# Altium project Velvet_Controller_V2.0_2023.PrjPcb (part 1 of 3)
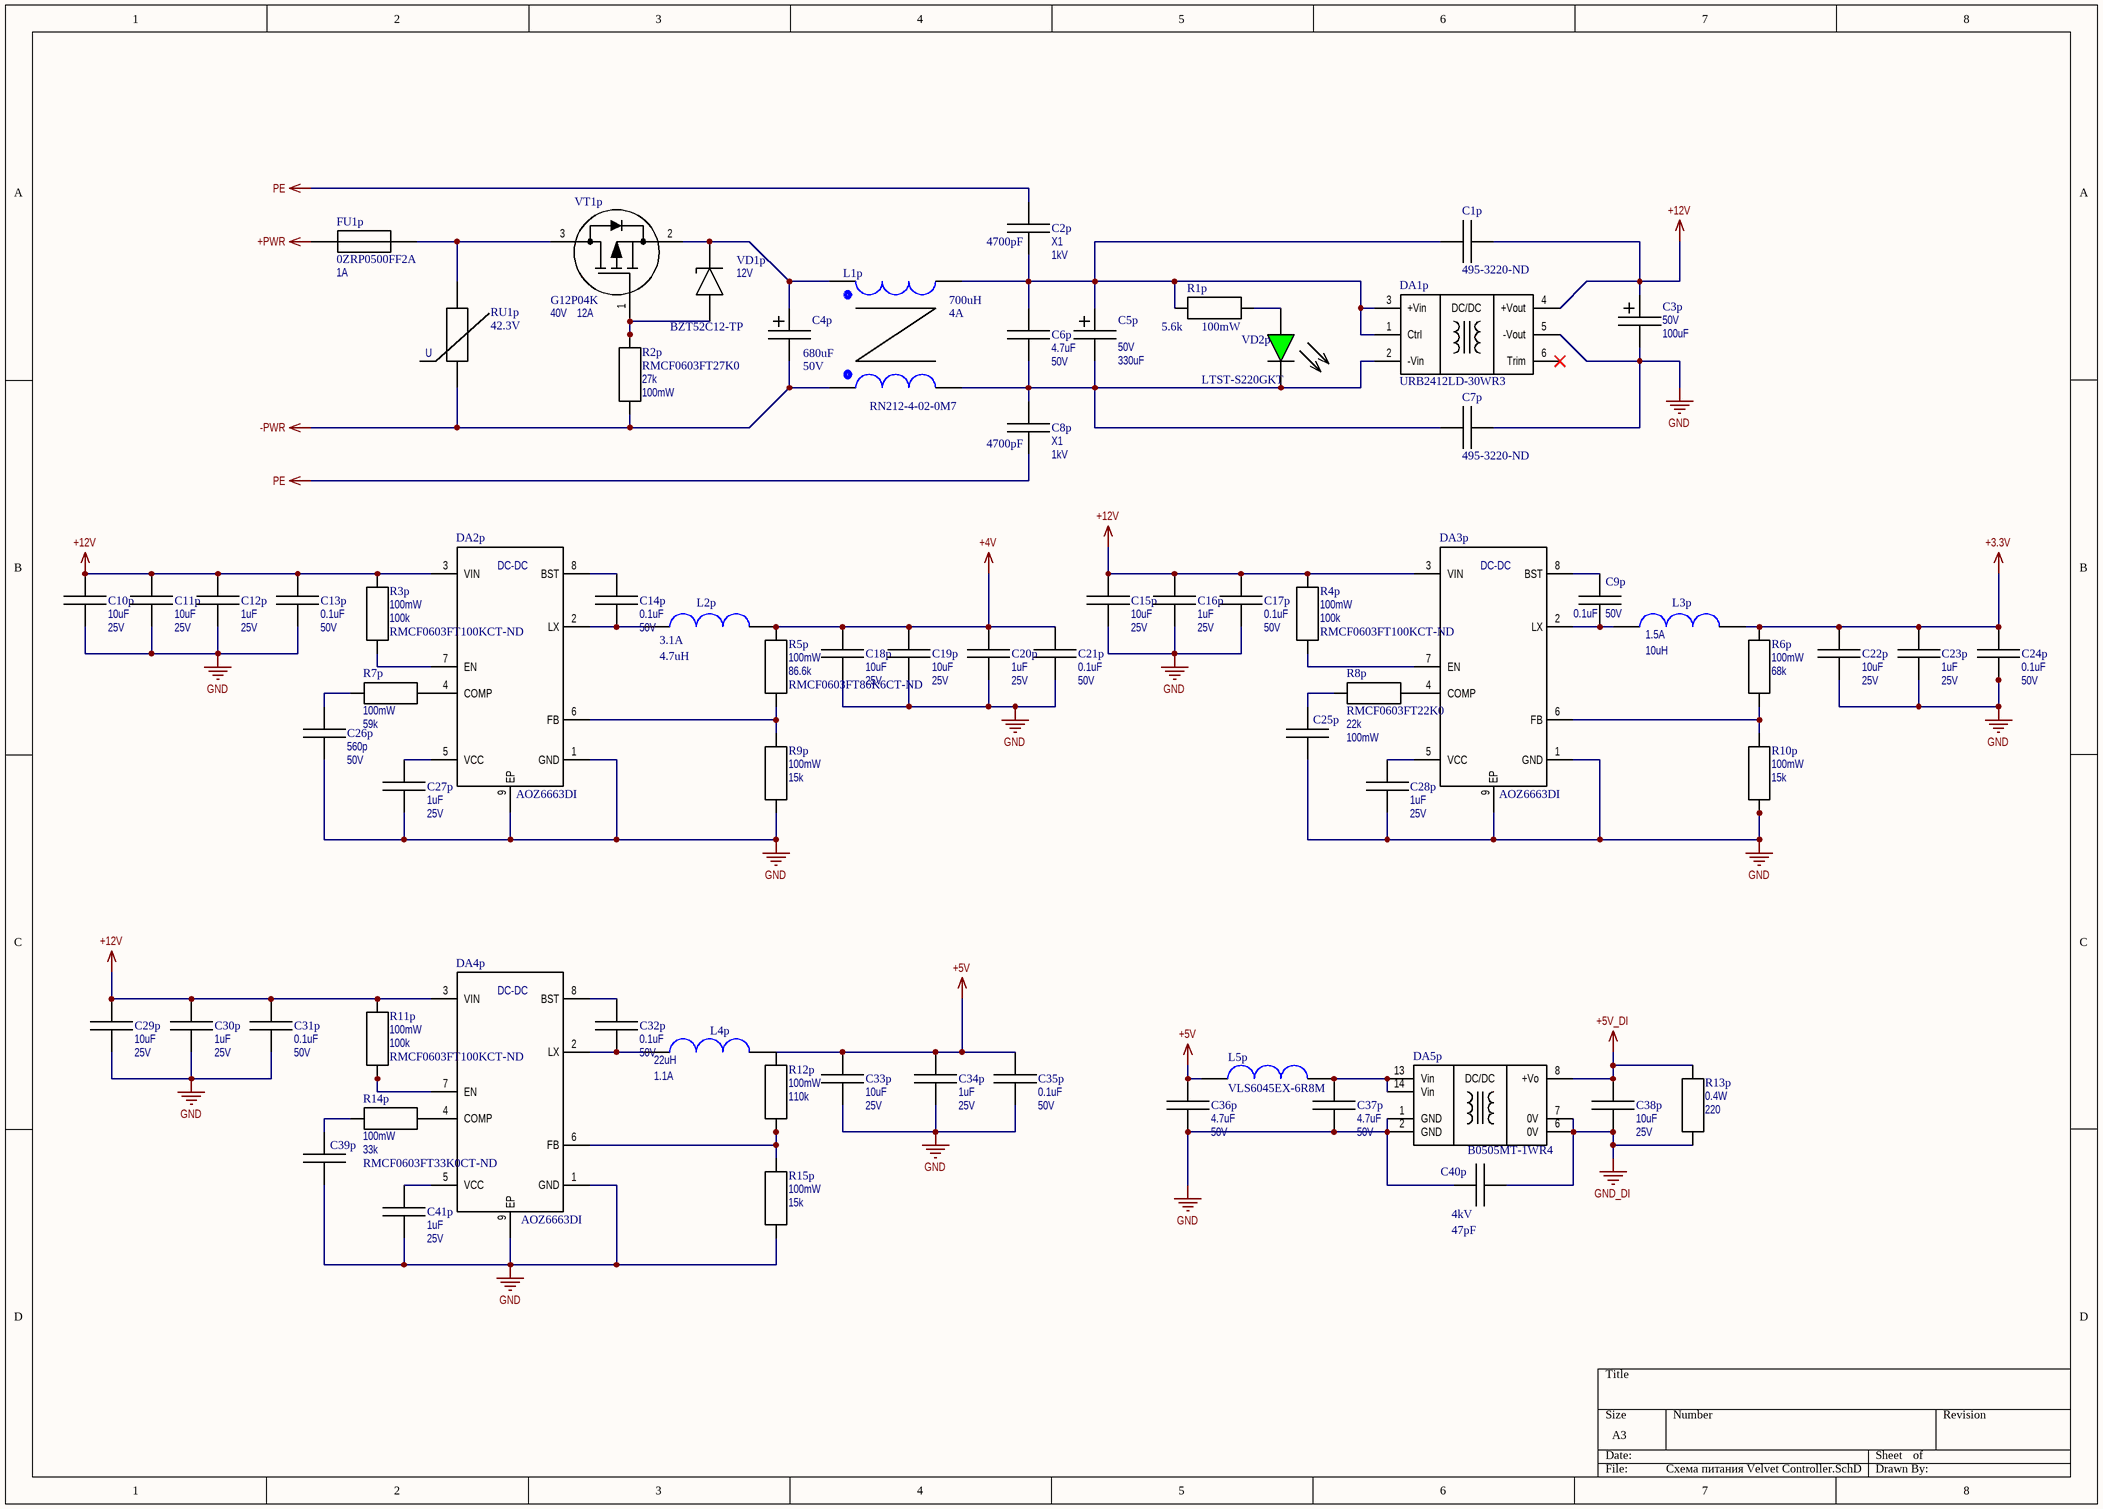
[diagram p0: Схема питания Velvet Controller.SchDoc]
6 sheets, 335 parts. Net scope: global (net labels, ports and power ports of the same name join across sheets).
Board file: Velvet_Controller_V2.0_2023.PcbDoc
Sheets:
  Схема питания Velvet Controller.SchDoc
  Схема МК и датчиков Velvet Controller.SchDoc
  Схема LoRa и RFID Velvet Controller.SchDoc
  Схема Wi-Fi Velvet Controller.SchDoc
  Схема GSM Velvet Controller.SchDoc
  Схема дискретных входов и выходов.SchDoc

## Sheet Схема питания Velvet Controller.SchDoc
size A3; SheetNumber: 1; SheetTotal: 6

### Parts
C1p  Supplier Part Number 1: 495-3220-ND  [CAP RADIAL L18.0 W5.0 H10.5 P15.0]  (hidden comment: B32672L8122J000)
C2p  Capacitance: 4700pF  Type: X1  Rated Voltage: 1kV  [CAP RADIAL L13.0 W4.0 H9.1 P10.0]  (hidden comment: R474F147050A1M)
C3p  Voltage Rated: 50V  Capacitance: 100uF  [CAP RADIAL D8.0 L12.0 P5.0]  (hidden comment: ECA-1HM101B)
C4p  Capacitance: 680uF  Voltage Rated: 50V  [CAP RADIAL D12.5 L20.0 P5.0]  (hidden comment: 50PX680MEFC12.5X20)
C5p  Voltage Rated: 50V  Capacitance: 330uF  [CAP RADIAL D10.0 L17,0 P5.0]  (hidden comment: ECA-1HM331B)
C6p  Capacitance: 4.7uF  Rated Voltage: 50V  [CAP 0805 IPC MAX]  (hidden comment: CL21A475KBQNNNE)
C7p  Supplier Part Number 1: 495-3220-ND  [CAP RADIAL L18.0 W5.0 H10.5 P15.0]  (hidden comment: B32672L8122J000)
C8p  Capacitance: 4700pF  Type: X1  Rated Voltage: 1kV  [CAP RADIAL L13.0 W4.0 H9.1 P10.0]  (hidden comment: R474F147050A1M)
C9p  Capacitance: 0.1uF  Rated Voltage: 50V  [CAP 0603 IPC MAX]  (hidden comment: GCM188R71H104KA57D)
C10p  Capacitance: 10uF  Rated Voltage: 25V  [CAP 1206 IPC MAX]  (hidden comment: CL31B106KAHNNNE)
C11p  Capacitance: 10uF  Rated Voltage: 25V  [CAP 1206 IPC MAX]  (hidden comment: CL31B106KAHNNNE)
C12p  Capacitance: 1uF  Rated Voltage: 25V  [CAP 0603 IPC MAX]  (hidden comment: TMK107BJ105KA-T)
C13p  Capacitance: 0.1uF  Rated Voltage: 50V  [CAP 0603 IPC MAX]  (hidden comment: GCM188R71H104KA57D)
C14p  Capacitance: 0.1uF  Rated Voltage: 50V  [CAP 0603 IPC MAX]  (hidden comment: GCM188R71H104KA57D)
C15p  Capacitance: 10uF  Rated Voltage: 25V  [CAP 1206 IPC MAX]  (hidden comment: CL31B106KAHNNNE)
C16p  Capacitance: 1uF  Rated Voltage: 25V  [CAP 0603 IPC MAX]  (hidden comment: TMK107BJ105KA-T)
C17p  Capacitance: 0.1uF  Rated Voltage: 50V  [CAP 0603 IPC MAX]  (hidden comment: GCM188R71H104KA57D)
C18p  Capacitance: 10uF  Rated Voltage: 25V  [CAP 1206 IPC MAX]  (hidden comment: CL31B106KAHNNNE)
C19p  Capacitance: 10uF  Rated Voltage: 25V  [CAP 1206 IPC MAX]  (hidden comment: CL31B106KAHNNNE)
C20p  Capacitance: 1uF  Rated Voltage: 25V  [CAP 0603 IPC MAX]  (hidden comment: TMK107BJ105KA-T)
C21p  Capacitance: 0.1uF  Rated Voltage: 50V  [CAP 0603 IPC MAX]  (hidden comment: GCM188R71H104KA57D)
C22p  Capacitance: 10uF  Rated Voltage: 25V  [CAP 1206 IPC MAX]  (hidden comment: CL31B106KAHNNNE)
C23p  Capacitance: 1uF  Rated Voltage: 25V  [CAP 0603 IPC MAX]  (hidden comment: TMK107BJ105KA-T)
C24p  Capacitance: 0.1uF  Rated Voltage: 50V  [CAP 0603 IPC MAX]  (hidden comment: GCM188R71H104KA57D)
C25p  CAP  [RES 0603 IPC MAX]  (value not drawn)
C26p  Capacitance: 560p  Rated Voltage: 50V  [CAP 0603 IPC MAX]  (hidden comment: CC0603KRX7R9BB561)
C27p  Capacitance: 1uF  Rated Voltage: 25V  [CAP 0603 IPC MAX]  (hidden comment: TMK107BJ105KA-T)
C28p  Capacitance: 1uF  Rated Voltage: 25V  [CAP 0603 IPC MAX]  (hidden comment: TMK107BJ105KA-T)
C29p  Capacitance: 10uF  Rated Voltage: 25V  [CAP 1206 IPC MAX]  (hidden comment: CL31B106KAHNNNE)
C30p  Capacitance: 1uF  Rated Voltage: 25V  [CAP 0603 IPC MAX]  (hidden comment: TMK107BJ105KA-T)
C31p  Capacitance: 0.1uF  Rated Voltage: 50V  [CAP 0603 IPC MAX]  (hidden comment: GCM188R71H104KA57D)
C32p  Capacitance: 0.1uF  Rated Voltage: 50V  [CAP 0603 IPC MAX]  (hidden comment: GCM188R71H104KA57D)
C33p  Capacitance: 10uF  Rated Voltage: 25V  [CAP 1206 IPC MAX]  (hidden comment: CL31B106KAHNNNE)
C34p  Capacitance: 1uF  Rated Voltage: 25V  [CAP 0603 IPC MAX]  (hidden comment: TMK107BJ105KA-T)
C35p  Capacitance: 0.1uF  Rated Voltage: 50V  [CAP 0603 IPC MAX]  (hidden comment: GCM188R71H104KA57D)
C36p  Capacitance: 4.7uF  Rated Voltage: 50V  [CAP 0805 IPC MAX]  (hidden comment: CL21A475KBQNNNE)
C37p  Capacitance: 4.7uF  Rated Voltage: 50V  [CAP 0805 IPC MAX]  (hidden comment: CL21A475KBQNNNE)
C38p  Capacitance: 10uF  Rated Voltage: 25V  [CAP 1206 IPC MAX]  (hidden comment: CL31B106KAHNNNE)
C39p  CAP  [RES 0603 IPC MAX]  (value not drawn)
C40p  Capacitance: 47pF  Rated Voltage: 4kV  [CC45SL3JD470JYVNA]  (hidden comment: CC45SL3JD470JYVNA)
C41p  Capacitance: 1uF  Rated Voltage: 25V  [CAP 0603 IPC MAX]  (hidden comment: TMK107BJ105KA-T)
DA1p  URB2412LD-30WR3  [URB2412LD-30WR3]
DA2p  AOZ6663DI  [DFN 3x3-8L]
DA3p  AOZ6663DI  [DFN 3x3-8L]
DA4p  AOZ6663DI  [DFN 3x3-8L]
DA5p  B0505MT-1WR4  [B0505MT-1WR4]
FU1p  0ZRP0500FF2A  Current Hold: 1A  [0ZRP0500FF2A]
L1p  RN212-4-02-0M7  Inductance: 700uH  Current Rating: 4A  [FIXED IND RN212-4-02-0M7]
L2p  Inductance: 4.7uH  Current Rating: 3.1A  [SRN5040]  (hidden comment: SRN5040-4R7M)
L3p  Inductance: 10uH  Current Rating: 1.5A  [ASPI-4030S]  (hidden comment: ASPI-4030S-100M-T)
L4p  Inductance: 22uH  Current Rating: 1.1A  [TYS5020]  (hidden comment: TYS5020220M-10)
L5p  VLS6045EX-6R8M  [VLS6045EX]
R1p  Resistance: 5.6k  Rated Power: 100mW  [RES 0603 IPC MAX]  (hidden comment: RMCF0603FT5K60)
R2p  RMCF0603FT27K0  Resistance: 27k  Rated Power: 100mW  [RES 0603 IPC MAX]
R3p  Power Rated: 100mW  Resistance: 100k  Supplier Part Number 1: RMCF0603FT100KCT-ND  [RES 0603 IPC MAX]  (hidden comment: RMCF0603FT100K)
R4p  Power Rated: 100mW  Resistance: 100k  Supplier Part Number 1: RMCF0603FT100KCT-ND  [RES 0603 IPC MAX]  (hidden comment: RMCF0603FT100K)
R5p  Power Rated: 100mW  Resistance: 86.6k  Supplier Part Number 1: RMCF0603FT86K6CT-ND  [RES 0603 IPC MAX]  (hidden comment: RMCF0603FT86K6)
R6p  Power Rated: 100mW  Resistance: 68k  [RES 0603 IPC MAX]  (hidden comment: RMCF0603FT68K0)
R7p  Power Rated: 100mW  Resistance: 59k  [RES 0603 IPC MAX]  (hidden comment: RMCF0603FT59K0)
R8p  RMCF0603FT22K0  Resistance: 22k  Power Rated: 100mW  [RES 0603 IPC MAX]
R9p  Power Rated: 100mW  Resistance: 15k  [RES 0603 IPC MAX]  (hidden comment: RMCF0603FT15K0)
R10p  Power Rated: 100mW  Resistance: 15k  [RES 0603 IPC MAX]  (hidden comment: RMCF0603FT15K0)
R11p  Power Rated: 100mW  Resistance: 100k  Supplier Part Number 1: RMCF0603FT100KCT-ND  [RES 0603 IPC MAX]  (hidden comment: RMCF0603FT100K)
R12p  Power Rated: 100mW  Resistance: 110k  [RES 0603 IPC MAX]  (hidden comment: RMCF0603FT110K)
R13p  Power Rated: 0.4W  Resistance: 220  [RES 0805 IPC MAX]  (hidden comment: ESR10EZPF2200)
R14p  Power Rated: 100mW  Resistance: 33k  Supplier Part Number 1: RMCF0603FT33K0CT-ND  [RES 0603 IPC MAX]  (hidden comment: RMCF0603FT33K0)
R15p  Power Rated: 100mW  Resistance: 15k  [RES 0603 IPC MAX]  (hidden comment: RMCF0603FT15K0)
RU1p  Varistor Voltage (Min): 42.3V  [B72220S0300K101]  (hidden comment: B72220S0300K101)
VD1p  BZT52C12-TP  Zener Voltage: 12V  [SOD-123 (Marked)]
VD2p  LTST-S220GKT  [0805 DIODE]
VT1p  G12P04K  Vds Max: 40V  Max Drain Current: 12A  [TO-252 (D-PAK)]

### Nets
+3.3V: C22p.1 C23p.1 C24p.1 L3p.2 R6p.1
+4V: C18p.1 C19p.1 C20p.1 C21p.1 L2p.2 R5p.1
+5V: C33p.1 C34p.1 C35p.1 C36p.1 L4p.2 L5p.1 R12p.2
+5V_DI: C38p.1 DA5p.8(+Vo) R13p.2
+12V: C1p.2 C3p.1 C10p.1 C11p.1 C12p.1 C13p.1 C15p.1 C16p.1 C17p.1 C29p.1 C30p.1 C31p.1 DA1p.4(+Vout) DA2p.3(VIN) DA3p.3(VIN) DA4p.3(VIN) R3p.2 R4p.1 R11p.1
+PWR: FU1p.1
-PWR: C4p.2 L1p.3 R2p.1 RU1p.1
GND: C3p.2 C7p.2 C10p.2 C11p.2 C12p.2 C13p.2 C15p.2 C16p.2 C17p.2 C18p.2 C19p.2 C20p.2 C21p.2 C22p.2 C23p.2 C24p.2 C25p.2 C26p.2 C27p.2 C28p.2 C29p.2 C30p.2 C31p.2 C33p.2 C34p.2 C35p.2 C36p.2 C37p.2 C39p.2 C40p.1 C41p.2 DA1p.5(-Vout) DA2p.1(GND) DA2p.9(EP) DA3p.1(GND) DA3p.9(EP) DA4p.1(GND) DA4p.9(EP) DA5p.1(GND) DA5p.2(GND) R9p.1 R10p.1 R15p.1
GND_DI: C38p.2 C40p.2 DA5p.6(0V) DA5p.7(0V) R13p.1
PE: C2p.1 C8p.2
NetC1p_1: C1p.1 C2p.2 C5p.1 C6p.1 DA1p.1(Ctrl) DA1p.3(+Vin) L1p.2 R1p.1
NetC4p_1: C4p.1 L1p.1 VD1p.1 VT1p.2(S)
NetC5p_2: C5p.2 C6p.2 C7p.1 C8p.1 DA1p.2(-Vin) L1p.4 VD2p.2
NetC9p_1: C9p.1 DA3p.8(BST)
NetC9p_2: C9p.2 DA3p.2(LX) L3p.1
NetC14p_1: C14p.1 DA2p.8(BST)
NetC14p_2: C14p.2 DA2p.2(LX) L2p.1
NetC25p_1: C25p.1 R8p.1
NetC26p_1: C26p.1 R7p.1
NetC27p_1: C27p.1 DA2p.5(VCC)
NetC28p_1: C28p.1 DA3p.5(VCC)
NetC32p_1: C32p.1 DA4p.8(BST)
NetC32p_2: C32p.2 DA4p.2(LX) L4p.1
NetC37p_1: C37p.1 DA5p.13(Vin) DA5p.14(Vin) L5p.2
NetC39p_1: C39p.1 R14p.2
NetC41p_1: C41p.1 DA4p.5(VCC)
NetDA2p_4: DA2p.4(COMP) R7p.2
NetDA2p_6: DA2p.6(FB) R5p.2 R9p.2
NetDA2p_7: DA2p.7(EN) R3p.1
NetDA3p_4: DA3p.4(COMP) R8p.2
NetDA3p_6: DA3p.6(FB) R6p.2 R10p.2
NetDA3p_7: DA3p.7(EN) R4p.2
NetDA4p_4: DA4p.4(COMP) R14p.1
NetDA4p_6: DA4p.6(FB) R12p.1 R15p.2
NetDA4p_7: DA4p.7(EN) R11p.2
NetFU1p_2: FU1p.2 RU1p.2 VT1p.3(D)
NetR1p_2: R1p.2 VD2p.1
NetR2p_2: R2p.2 VD1p.2 VT1p.1(G)

Not connected (* = marked no-connect by the designer): DA1p 6(Trim)*

### Notes on the sheet
- (in symbol AOZ6663DI) DC-DC
- (in symbol B0505MT-1WR4) DC/DC
- (in symbol B72220S0300K101) U
- (in symbol URB2412LD-30WR3) DC/DC

### Library data of the parts
C1p C7p = B32672L8122J000: CAP FILM 1200PF 5% 2KVDC RADIAL; Manufacturer 1: EPCOS - TDK Electronics; Rated Voltage: 2kV; Type: MKP; Manufacturer Part Number 1: B32672L8122J000; Min Operating Temperature: -55°C; Max Operating Temperature: 110°C; Capacitance: 1200pF; Tolerance: 5%; Mounting: T/H; Package: 18mm x 5mm x 10.5mm; Lead Spacing: 15mm; Supplier 1: Digi-Key
C2p C8p = R474F147050A1M: CAP FILM 4700PF 20% 1KVDC RAD; Manufacturer 1: KEMET; Manufacturer Part Number 1: R474F147050A1M; Min Operating Temperature: -40°C; Max Operating Temperature: 110°C; Tolerance: 20%; Mounting: T/H; Package: 13mm x 4mm x 9.1mm; Lead Spacing: 10mm; Supplier 1: Digi-Key; Supplier Part Number 1: 399-13727-ND
C3p = ECA-1HM101B: CAP ALUM 100UF 20% 50V RADIAL; Manufacturer 1: Panasonic Electronic Components; Capacitor Type: Aluminium Electrolytic; Ripple Current @ Low Frequency: 250mA; Ripple Current @ High Frequency: 425mA; Manufacturer Part Number 1: ECA-1HM101B; Min Operating Temperature: -40°C; Max Operating Temperature: 85°C; Lead Spacing: 5mm; Diameter: 8mm; Height: 12.5mm; Tolerance: 20%; Supplier 1: Digi-Key; Supplier Part Number 1: P5182-ND
C4p = 50PX680MEFC12.5X20: CAP ALUM 680UF 20% 50V RADIAL; Manufacturer 1: Rubycon; Capacitor Type: Aluminium Electrolytic; Ripple Current @ Low Frequency: 980mA; Ripple Current @ High Frequency: 1.176A; Manufacturer Part Number 1: 50PX680MEFC12.5X20; Min Operating Temperature: -55°C; Max Operating Temperature: 105°C; Lead Spacing: 5mm; Diameter: 12.5mm; Height: 21.5mm; Tolerance: 20%
C5p = ECA-1HM331B: CAP ALUM 330UF 20% 50V RADIAL; Manufacturer 1: Panasonic Electronic Components; Capacitor Type: Aluminium Electrolytic; Ripple Current @ Low Frequency: 500mA; Ripple Current @ High Frequency: 850A; Manufacturer Part Number 1: ECA-1HM331B; Min Operating Temperature: -40°C; Max Operating Temperature: 85°C; Lead Spacing: 5mm; Diameter: 10mm; Height: 17mm; Tolerance: 20%
C6p C36p C37p = CL21A475KBQNNNE: CAP SMD CER 4.7UF 50V X5R 0805; Manufacturer 1: Samsung Electro-Mechanics; Tolerance: 10%; Type: Multilayer Ceramic; Manufacturer Part Number 1: CL21A475KBQNNNE; Min Operating Temperature: -55°C; Max Operating Temperature: 85°C; Mounting: SM; Package: 0805; Supplier 1: Digi-Key; Supplier Part Number 1: 1276-1248-1-ND
C9p C13p C14p C17p C21p C24p C31p C32p C35p = GCM188R71H104KA57D: CAP SMD CER 0.1UF 50V X7R 0603; Manufacturer 1: Murata Electronics; Tolerance: 10%; Type: Multilayer Ceramic; Manufacturer Part Number 1: GCM188R71H104KA57D; Min Operating Temperature: -55°C; Max Operating Temperature: 125°C; Mounting: SM; Package: 0603; Supplier 1: Digi-Key; Supplier Part Number 1: 490-4779-1-ND
C10p C11p C15p C18p C19p C22p C29p C33p C38p = CL31B106KAHNNNE: CAP SMD CER 10UF 25V X7R 1206; Manufacturer 1: Samsung Electro-Mechanics; Tolerance: 10%; Type: Multilayer Ceramic; Manufacturer Part Number 1: CL31B106KAHNNNE; Min Operating Temperature: -55°C; Max Operating Temperature: 125°C; Mounting: SM; Package: 1206; Supplier 1: Digi-Key; Supplier Part Number 1: 1276-1804-1-ND
C12p C16p C20p C23p C27p C28p C30p C34p C41p = TMK107BJ105KA-T: CAP SMD CER 1UF 25V X5R 0603; Manufacturer 1: Taiyo Yuden; Tolerance: 10%; Type: Multilayer Ceramic; Manufacturer Part Number 1: TMK107BJ105KA-T; Min Operating Temperature: -55°C; Max Operating Temperature: 85°C; Mounting: SM; Package: 0603; Supplier 1: Digi-Key; Supplier Part Number 1: 587-1248-1-ND
C25p C39p = CAP GOST: CAP ??UF ??% ??V Package?
C26p = CC0603KRX7R9BB561: CAP SMD CER 560PF 50V X7R 0603; Manufacturer 1: YAGEO; Tolerance: 10%; Type: Multilayer Ceramic; Manufacturer Part Number 1: CC0603KRX7R9BB561; Min Operating Temperature: -55°C; Max Operating Temperature: 125°C; Mounting: SM; Package: 0603; Supplier 1: Digi-Key; Supplier Part Number 1: 311-1079-1-ND
C40p = CC45SL3JD470JYVNA: CAP SMD CER 47PF 6KV SL RADIAL; Manufacturer 1: TDK Corporation; Tolerance: 5%; Type: High Voltage; Manufacturer Part Number 1: CC45SL3JD470JYVNA; Min Operating Temperature: -25°C; Max Operating Temperature: 125°C; Mounting: T/H; Package: Radial
DA1p = URB2412LD-30WR3: DC DC CONVERTER 12V 30W; Max Input Voltage DC: 36V; Min Input Voltage DC: 9V; Max Output Current: 2.5A; Efficiency: 90%; Output Voltage Ripple: 100mV; Operating Frequency: 300kHz; Output Voltage DC: 12V; Power Rating: 30W; Application: ITE (Commercial); Min Operating Temperature: +80℃; Max Operating Temperature: -40℃; Mounting Type: T/H; Pins: 6; Size: 50.8mm x 25.4mm x 11.8mm; Help URL: https://www.mornsun-power.com/html/pdf/URB2412LD-30WR3.html; Supplier 1: Digi-Key; Supplier Part Number 1: 2725-URB2412LD-30WR3-ND
DA2p DA3p DA4p = AOZ6663DI: IC REG BUCK ADJ 3A 8DFN; Manufacturer 1: Alpha & Omega Semiconductor Inc.; Min Input Voltage: 4.5V; Max Input Voltage: 20V; Min Output Voltage: 0.6V; Max Output Voltage: 7V; Max Operating Frequency: 750kHz; Max Pulsed Current: 3.2A; Supplier 1: Digi-Key; Supplier Part Number 1: 785-1855-1-ND; Manufacturer Part Nubmer 1: AOZ6663DI; Type: Buck
DA5p = B0505MT-1WR4: DC DC CONVERTER 5V 1W; Max Input Voltage DC: 5.5V; Min Input Voltage DC: 4.5V; Max Output Current: 200mA; Efficiency: 8%; Output Voltage Ripple: 100mV; Operating Frequency: 300kHz; Output Voltage DC: 5V; Power Rating: 1W; Application: ITE (Commercial); Min Operating Temperature: +125℃; Max Operating Temperature: -40℃; Mounting Type: SM; Pins: 7; Size: L9.0W7.0H3.1P1.27; Help URL: https://www.mornsun-power.com/html/pdf/B0505MT-1WR4.html; Supplier 1: Digi-Key; Supplier Part Number 1: 2725-B0505MT-1WR4CT-ND
FU1p = 0ZRP0500FF2A: PTC RESET FUSE 60V 5A RADIAL; Manufacturer 1: Bel Fuse Inc.; Current Trip: 10A; Time To Trip: 28s; Initial Resistance: 12mOhm; Max Current: 40A; Min Operating Temperature: -40°C; Max Operating Temperature: 85°C; Manufacturer Part Number 1: 0ZRP0500FF2A; Supplier 1: Digi-Key; Supplier Part Number 1: 507-0ZRP0500FF2ACT-ND
L1p = RN212-4-02-0M7: COMMON MODE CHOKE 700UH 4A 2LN TH; Manufacturer 1: Schaffner EMC Inc.; Shielding: Yes; DCR: 24mOhm; Manufacturer Part Number 1: RN212-4-02-0M7; Saturation Current: -; Min Operating Temperature: -40°C; Max Operating Temperature: 125°C; Supplier 1: Digi-Key; Supplier Part Number 1: 817-2176-ND
L2p = SRN5040-4R7M: FIXED IND 4.7UH 3.1A 35 MOHM SMD; Manufacturer 1: Bourns; Saturation Current: 3.3A; Shielding: Yes; DCR: 35mOhm; Manufacturer Part Number 1: SRN5040-4R7M; Min Operating Temperature: -40°C; Max Operating Temperature: 125°C; Supplier 1: Digi-Key; Supplier Part Number 1: SRN5040-4R7MCT-ND
L3p = ASPI-4030S-100M-T: FIXED IND 10UH 1.5A 100 MOHM SMD; Manufacturer 1: Abracon LLC; Saturation Current: 1.95A; Shielding: Yes; Manufacturer Part Number 1: ASPI-4030S-100M-T; DCR: 100mOhm; Min Operating Temperature: -40°C; Max Operating Temperature: 125°C; Supplier 1: Digi-Key; Supplier Part Number 1: 535-12314-1-ND
L4p = TYS5020220M-10: FIXED IND 22UH 1.1A 226 MOHM SMD; Manufacturer 1: Laird-Signal Integrity Products; Saturation Current: 1.15A; Shielding: Yes; Manufacturer Part Number 1: TYS5020220M-10; DCR: 226mOhm; Min Operating Temperature: -40°C; Max Operating Temperature: 125°C; Supplier 1: Digi-Key; Supplier Part Number 1: 240-2706-1-ND
L5p = VLS6045EX-6R8M: FIXED IND 6.8UH 3.6A 36 MOHM SMD; Manufacturer 1: TDK Corporation; Saturation Current: 4.7A; Shielding: Yes; DCR: 36mOhm; Manufacturer Part Number 1: VLS6045EX-6R8M; Inductance: 6.8uH; Current Rating: 3.6A; Min Operating Temperature: -40°C; Max Operating Temperature: 105°C; Supplier 1: Digi-Key; Supplier Part Number 1: 445-173057-1-ND
R1p = RMCF0603FT5K60: RES SMD 5.6K OHM 1% 1/10W 0603; Manufacturer Part Number 1: RMCF0603FT1K00; Manufacturer 1: Stackpole Electronics Inc; Rated Voltage: 75V; Qualification: AEC-Q200; Tolerance: 1%; Package: 0603; Min Operating Temperature: -55°C; Max Operating Temperature: 155°C
R2p = RMCF0603FT27K0: RES SMD 27K OHM 1% 1/10W 0603; Manufacturer 1: Stackpole Electronics Inc; Manufacturer Part Number 1: RMCF0603FT22K0; Rated Voltage: 75V; Max Operating Temperature: 155°C; Min Operating Temperature: -55°C; Tolerance: 1%; Package: 0603; Mounting: SM; Pins: 2; Ratings: AEC-Q200; Supplier 1: Digi-Key; Supplier Part Number 1: RMCF0603FT27K0CT-ND
R3p R4p R11p = RMCF0603FT100K: RES SMD 100K OHM 5% 1/10W 0603; Manufacturer 1: Stackpole Electronics Inc; Voltage Rated: 75V; Manufacturer Part Number 1: RMCF0603FT100K; Min Operating Temperature: -55°C; Max Operating Temperature: 155°C; Tolerance: 5%; Package: 0603; Ratings: AEC-Q200; Supplier 1: Digi-Key
R5p = RMCF0603FT86K6: RES SMD 86.6K OHM 5% 1/10W 0603; Manufacturer 1: Stackpole Electronics Inc; Voltage Rated: 75V; Manufacturer Part Number 1: RMCF0603FT86K6; Min Operating Temperature: -55°C; Max Operating Temperature: 155°C; Tolerance: 5%; Package: 0603; Ratings: AEC-Q200; Supplier 1: Digi-Key
R6p = RMCF0603FT68K0: RES SMD 68K OHM 1% 1/10W 0603; Manufacturer 1: Stackpole Electronics Inc; Voltage Rated: 75V; Manufacturer Part Number 1: RMCF0603FT68K0; Min Operating Temperature: -55°C; Max Operating Temperature: 155°C; Tolerance: 1%; Package: 0603; Ratings: AEC-Q200; Supplier 1: Digi-Key; Supplier Part Number 1: RMCF0603FT68K0CT-ND
R7p = RMCF0603FT59K0: RES SMD 59K OHM 5% 1/10W 0603; Manufacturer 1: Stackpole Electronics Inc; Voltage Rated: 75V; Manufacturer Part Number 1: RMCF0603FT59K0; Min Operating Temperature: -55°C; Max Operating Temperature: 155°C; Tolerance: 5%; Package: 0603; Ratings: AEC-Q200; Supplier 1: Digi-Key; Supplier Part Number 1: RMCF0603FT59K0CT-ND
R8p = RMCF0603FT22K0: RES SMD 22K OHM 1% 1/10W 0603; Manufacturer 1: Stackpole Electronics Inc; Min Operating Temnperature: -55°C; Voltage Rated: 75V; Manufacturer Part Number 1: RMCF0603FT22K0; Max Operating Temperature: 155°C; Tolerance: 1%; Package: 0603; Mounting: SM; Pins: 2; Rating: AEC-Q200; Supplier 1: Digi-Key; Supplier Part Number 1: RMCF0603FT22K0CT-ND
R9p R10p R15p = RMCF0603FT15K0: RES SMD 15K OHM 1% 1/10W 0603; Manufacturer 1: Stackpole Electronics Inc; Voltage Rated: 75V; Manufacturer Part Number 1: RMCF0603FT15K0; Min Operating Temperature: -55°C; Max Operating Temperature: 155°C; Tolerance: 1%; Package: 0603; Ratings: AEC-Q200; Supplier 1: Digi-Key; Supplier Part Number 1: RMCF0603FT15K0CT-ND
R12p = RMCF0603FT110K: RES SMD 110K OHM 1% 1/10W 0603; Manufacturer 1: Stackpole Electronics Inc; Voltage Rated: 75V; Tolerance: 5%; Manufacturer Part Number 1: RMCF0603FT110K; Min Operating Temperature: -55°C; Max Operating Temperature: 155°C; Package: 0603; Ratings: AEC-Q200; Supplier 1: Digi-Key; Supplier Part Number 1: RMCF0603FT110KCT-ND
R13p = ESR10EZPF2200: RES SMD 220 OHM 1% 0.4W 0805; Manufacturer 1: Rohm Semiconductor; Voltage Rated: 100V; Manufacturer Part Number 1: ESR10EZPF2200; Min Operating Temperature: -55°C; Max Operating Temperature: 155°C; Tolerance: 1%; Package: 0805; Ratings: AEC-Q200; Supplier 1: Digi-Key; Supplier Part Number 1: RHM220AECT-ND
R14p = RMCF0603FT33K0: RES SMD 33K OHM 1% 1/10W 0603; Manufacturer 1: Stackpole Electronics Inc; Voltage Rated: 75V; Manufacturer Part Number 1: RMCF0603FT33K0; Min Operating Temperature: -55°C; Max Operating Temperature: 155°C; Tolerance: 1%; Package: 0603; Ratings: AEC-Q200; Supplier 1: Digi-Key
RU1p = B72220S0300K101: VARISTOR 47V 2KA DISC 20MM S20K30; Manufacturer: EPCOS Inc; Number of Circuits: 1; Maximum AC Volts: 30V; Maximum DC Volts: 38W; Energy: 26J; Manufacturer Part Number: B72220S0300K101; RoHS Compliant: Yes; Current - Surge: 2kA; Package / Case: Disc 20mm; ComponentLink1URL: https://www.tdk-electronics.tdk.com/inf/70/db/var/SIOV_Leaded_StandarD.pdf?ref_disty=digikey; ComponentLink1Description: Datasheet; Supplier 1: Digi-Key; Supplier Part Number 1: 495-2405-ND
VD1p = BZT52C12-TP: DIODE ZENER 12V 200MW SOD123; Manufacturer 1: Micro Commercial Co; Tolerance: 5%; Max Impedance: 28 Ohm; Reverse Current: 100nA; Manufacturer Part Number 1: BZT52C12-TP; Min Operating Temperature: -65°C; Max Operating Temperature: 150°C; Max Power: 200mW; Package: SOD-123; Mounting: SM; Supplier 1: Digi-Key; Supplier Part Number 1: BZT52C12-TPMSCT-ND
VD2p = LTST-S220GKT: LED GREEN CLEAR SMD R/A; Manufacturer 1: Lite-On Inc.; Max Continious Current: 30mA; Max Pulse Current: 120mA; Reverse Voltage: 5V; Power Dissipation: 100mW; Forward Voltage: 2.2V; Manufacturer Part Number 1: LTST-S220GKT; Max Operating Temperature: +85°C; Package: 0805
VT1p = G12P04K: MOSFET P-CH 40V 12A TO-252; Manufacturer 1: Goford Semiconductor; Type: P-Chanel; Rds On (Max): 35mOhm; Vth: 2.5V; Gate Charge: 25nC; Vgs Max: 20V; Input Capacitance: 930pF; Max Power Dissipation: 50W; Min Operating Temperature: -55°C; Max Operating Temperature: 150°C; Mounting Type: SM; Package: TO-252; Manufacturer Part Number 1: G12P04K; Supplier 1: Digi-Key; Supplier Part Number 1: 3141-G12P04KCT-ND

## Sheet Схема МК и датчиков Velvet Controller.SchDoc
size A2; SheetNumber: 2; SheetTotal: 6
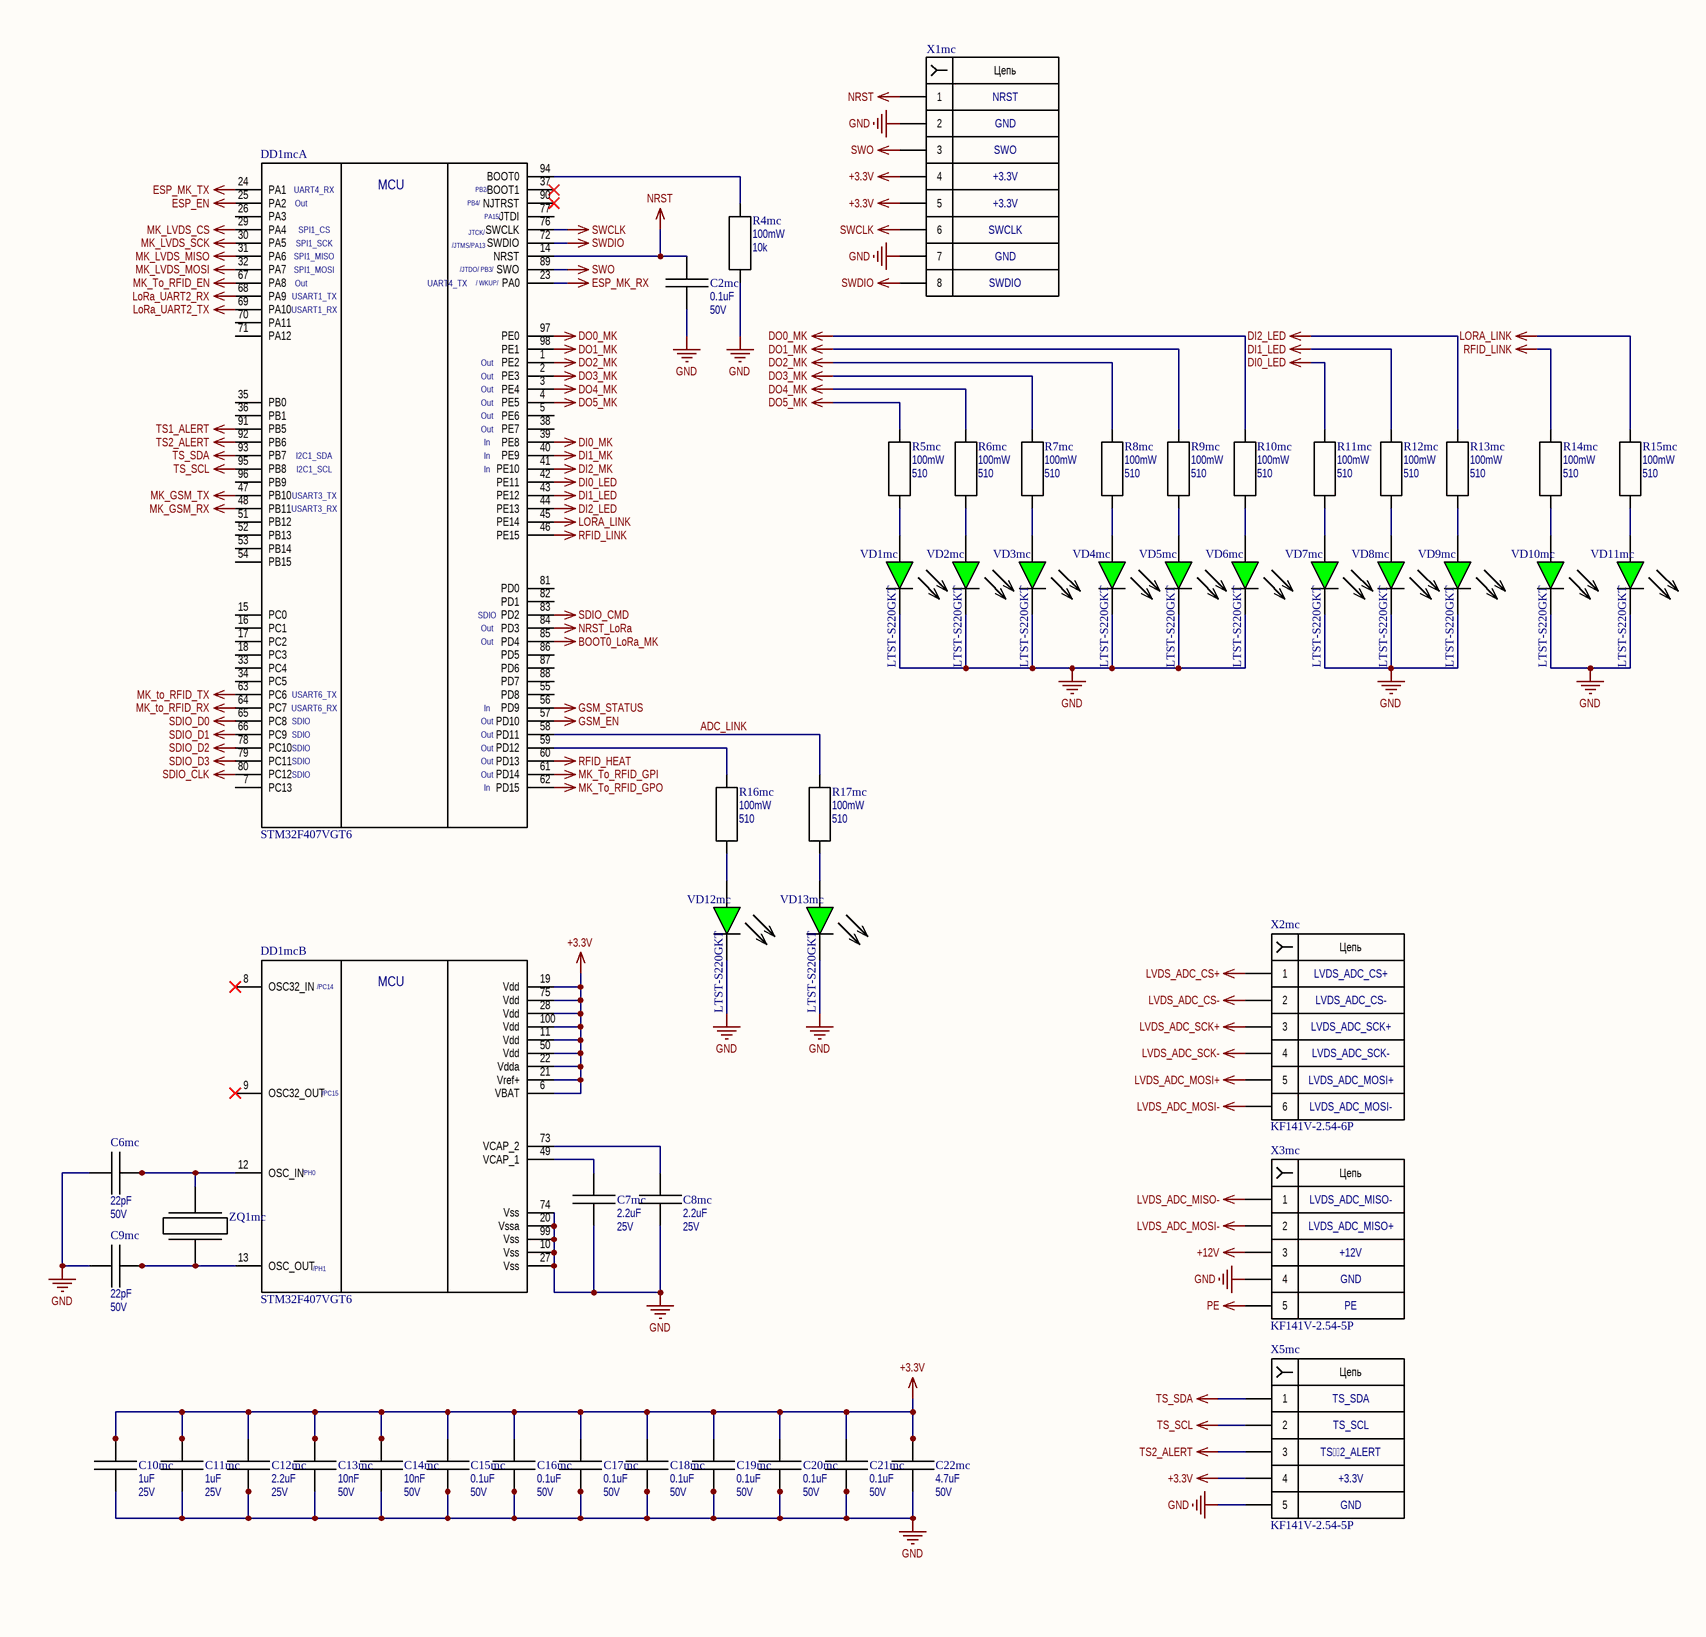
[diagram p1: Схема МК и датчиков Velvet Controller.SchDoc, left]
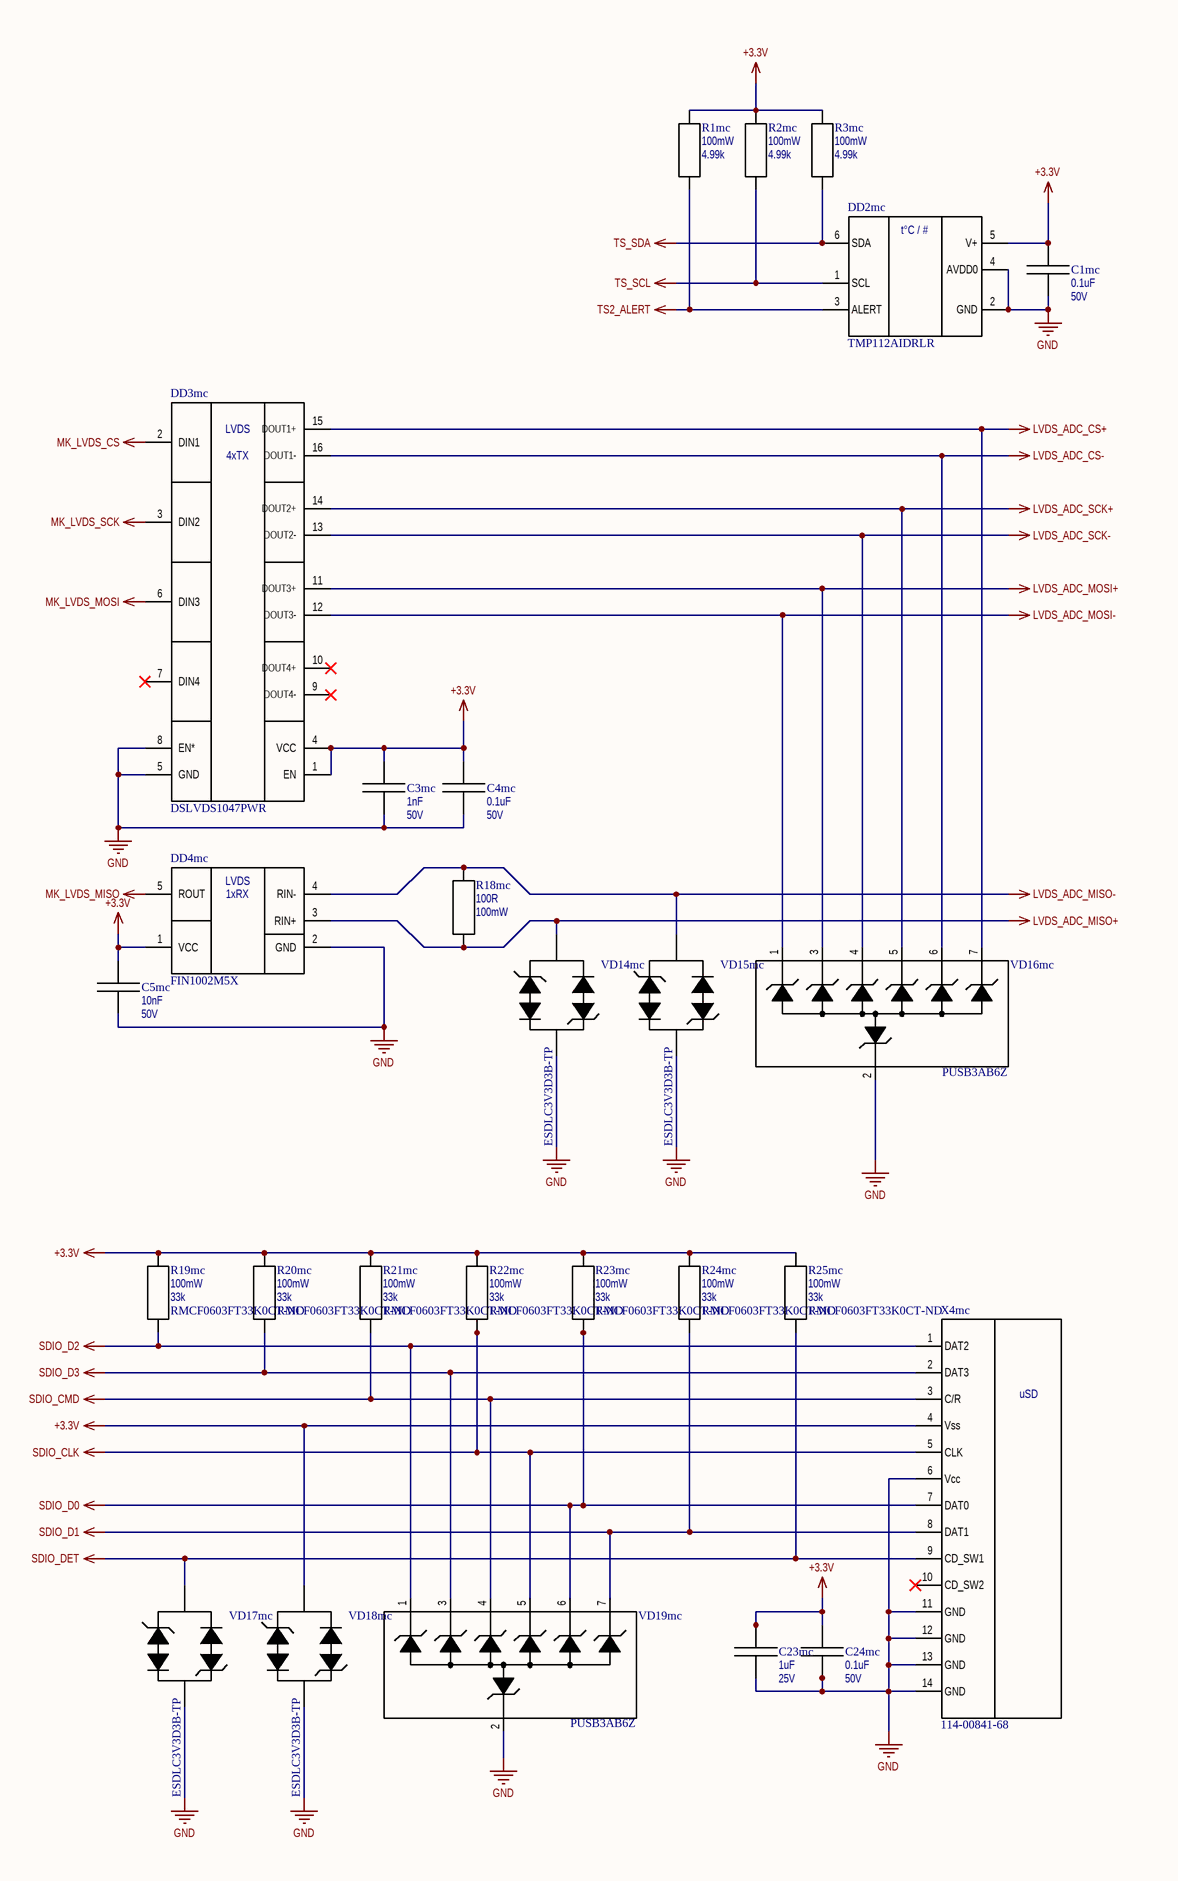
[diagram p2: Схема МК и датчиков Velvet Controller.SchDoc, right]

### Parts
C1mc  Capacitance: 0.1uF  Rated Voltage: 50V  [CAP 0603 IPC MAX]  (hidden comment: GCM188R71H104KA57D)
C2mc  Capacitance: 0.1uF  Rated Voltage: 50V  [CAP 0603 IPC MAX]  (hidden comment: GCM188R71H104KA57D)
C3mc  Capacitance: 1nF  Rated Voltage: 50V  [CAP 0603 IPC MAX]  (hidden comment: GCM188R71H102KA37D)
C4mc  Capacitance: 0.1uF  Rated Voltage: 50V  [CAP 0603 IPC MAX]  (hidden comment: GCM188R71H104KA57D)
C5mc  Capacitance: 10nF  Rated Voltage: 50V  [CAP 0603 IPC MAX]  (hidden comment: CL10B103KB8NNNC)
C6mc  Capacitance: 22pF  Rated Voltage: 50V  [CAP 0603 IPC MAX]  (hidden comment: CC0603JRNPO9BN220)
C7mc  Capacitance: 2.2uF  Rated Voltage: 25V  [CAP 0603 IPC MAX]  (hidden comment: GRM188R61E225KA12D)
C8mc  Capacitance: 2.2uF  Rated Voltage: 25V  [CAP 0603 IPC MAX]  (hidden comment: GRM188R61E225KA12D)
C9mc  Capacitance: 22pF  Rated Voltage: 50V  [CAP 0603 IPC MAX]  (hidden comment: CC0603JRNPO9BN220)
C10mc  Capacitance: 1uF  Rated Voltage: 25V  [CAP 0603 IPC MAX]  (hidden comment: TMK107BJ105KA-T)
C11mc  Capacitance: 1uF  Rated Voltage: 25V  [CAP 0603 IPC MAX]  (hidden comment: TMK107BJ105KA-T)
C12mc  Capacitance: 2.2uF  Rated Voltage: 25V  [CAP 0603 IPC MAX]  (hidden comment: GRM188R61E225KA12D)
C13mc  Capacitance: 10nF  Rated Voltage: 50V  [CAP 0603 IPC MAX]  (hidden comment: CL10B103KB8NNNC)
C14mc  Capacitance: 10nF  Rated Voltage: 50V  [CAP 0603 IPC MAX]  (hidden comment: CL10B103KB8NNNC)
C15mc  Capacitance: 0.1uF  Rated Voltage: 50V  [CAP 0603 IPC MAX]  (hidden comment: GCM188R71H104KA57D)
C16mc  Capacitance: 0.1uF  Rated Voltage: 50V  [CAP 0603 IPC MAX]  (hidden comment: GCM188R71H104KA57D)
C17mc  Capacitance: 0.1uF  Rated Voltage: 50V  [CAP 0603 IPC MAX]  (hidden comment: GCM188R71H104KA57D)
C18mc  Capacitance: 0.1uF  Rated Voltage: 50V  [CAP 0603 IPC MAX]  (hidden comment: GCM188R71H104KA57D)
C19mc  Capacitance: 0.1uF  Rated Voltage: 50V  [CAP 0603 IPC MAX]  (hidden comment: GCM188R71H104KA57D)
C20mc  Capacitance: 0.1uF  Rated Voltage: 50V  [CAP 0603 IPC MAX]  (hidden comment: GCM188R71H104KA57D)
C21mc  Capacitance: 0.1uF  Rated Voltage: 50V  [CAP 0603 IPC MAX]  (hidden comment: GCM188R71H104KA57D)
C22mc  Capacitance: 4.7uF  Rated Voltage: 50V  [CAP 0805 IPC MAX]  (hidden comment: CL21A475KBQNNNE)
C23mc  Capacitance: 1uF  Rated Voltage: 25V  [CAP 0603 IPC MAX]  (hidden comment: TMK107BJ105KA-T)
C24mc  Capacitance: 0.1uF  Rated Voltage: 50V  [CAP 0603 IPC MAX]  (hidden comment: GCM188R71H104KA57D)
DD1mc  STM32F407VGT6  [LQFP50P1600X1600X160-100M]  (parts A,B of 2)
DD2mc  TMP112AIDRLR  [SOT-563]
DD3mc  DSLVDS1047PWR  [TSSOP-16]
DD4mc  FIN1002M5X  [SOT-23-5]
R1mc  Rated Power: 100mW  Resistance: 4.99k  [RES 0603 IPC MAX]  (hidden comment: RC0603FR-074K99L)
R2mc  Rated Power: 100mW  Resistance: 4.99k  [RES 0603 IPC MAX]  (hidden comment: RC0603FR-074K99L)
R3mc  Rated Power: 100mW  Resistance: 4.99k  [RES 0603 IPC MAX]  (hidden comment: RC0603FR-074K99L)
R4mc  Power Rated: 100mW  Resistance: 10k  [RES 0603 IPC MAX]  (hidden comment: RMCF0603JT10K0)
R5mc  Power Rated: 100mW  Resistance: 510  [RES 0603 IPC MAX]  (hidden comment: RMCF0603JT510R)
R6mc  Power Rated: 100mW  Resistance: 510  [RES 0603 IPC MAX]  (hidden comment: RMCF0603JT510R)
R7mc  Power Rated: 100mW  Resistance: 510  [RES 0603 IPC MAX]  (hidden comment: RMCF0603JT510R)
R8mc  Power Rated: 100mW  Resistance: 510  [RES 0603 IPC MAX]  (hidden comment: RMCF0603JT510R)
R9mc  Power Rated: 100mW  Resistance: 510  [RES 0603 IPC MAX]  (hidden comment: RMCF0603JT510R)
R10mc  Power Rated: 100mW  Resistance: 510  [RES 0603 IPC MAX]  (hidden comment: RMCF0603JT510R)
R11mc  Power Rated: 100mW  Resistance: 510  [RES 0603 IPC MAX]  (hidden comment: RMCF0603JT510R)
R12mc  Power Rated: 100mW  Resistance: 510  [RES 0603 IPC MAX]  (hidden comment: RMCF0603JT510R)
R13mc  Power Rated: 100mW  Resistance: 510  [RES 0603 IPC MAX]  (hidden comment: RMCF0603JT510R)
R14mc  Power Rated: 100mW  Resistance: 510  [RES 0603 IPC MAX]  (hidden comment: RMCF0603JT510R)
R15mc  Power Rated: 100mW  Resistance: 510  [RES 0603 IPC MAX]  (hidden comment: RMCF0603JT510R)
R16mc  Power Rated: 100mW  Resistance: 510  [RES 0603 IPC MAX]  (hidden comment: RMCF0603JT510R)
R17mc  Power Rated: 100mW  Resistance: 510  [RES 0603 IPC MAX]  (hidden comment: RMCF0603JT510R)
R18mc  Resistance: 100R  Rated Power: 100mW  [RES 0603 IPC MAX]  (hidden comment: RMCF0603FT100R)
R19mc  Power Rated: 100mW  Resistance: 33k  Supplier Part Number 1: RMCF0603FT33K0CT-ND  [RES 0603 IPC MAX]  (hidden comment: RMCF0603FT33K0)
R20mc  Power Rated: 100mW  Resistance: 33k  Supplier Part Number 1: RMCF0603FT33K0CT-ND  [RES 0603 IPC MAX]  (hidden comment: RMCF0603FT33K0)
R21mc  Power Rated: 100mW  Resistance: 33k  Supplier Part Number 1: RMCF0603FT33K0CT-ND  [RES 0603 IPC MAX]  (hidden comment: RMCF0603FT33K0)
R22mc  Power Rated: 100mW  Resistance: 33k  Supplier Part Number 1: RMCF0603FT33K0CT-ND  [RES 0603 IPC MAX]  (hidden comment: RMCF0603FT33K0)
R23mc  Power Rated: 100mW  Resistance: 33k  Supplier Part Number 1: RMCF0603FT33K0CT-ND  [RES 0603 IPC MAX]  (hidden comment: RMCF0603FT33K0)
R24mc  Power Rated: 100mW  Resistance: 33k  Supplier Part Number 1: RMCF0603FT33K0CT-ND  [RES 0603 IPC MAX]  (hidden comment: RMCF0603FT33K0)
R25mc  Power Rated: 100mW  Resistance: 33k  Supplier Part Number 1: RMCF0603FT33K0CT-ND  [RES 0603 IPC MAX]  (hidden comment: RMCF0603FT33K0)
VD1mc  LTST-S220GKT  [0805 DIODE]
VD2mc  LTST-S220GKT  [0805 DIODE]
VD3mc  LTST-S220GKT  [0805 DIODE]
VD4mc  LTST-S220GKT  [0805 DIODE]
VD5mc  LTST-S220GKT  [0805 DIODE]
VD6mc  LTST-S220GKT  [0805 DIODE]
VD7mc  LTST-S220GKT  [0805 DIODE]
VD8mc  LTST-S220GKT  [0805 DIODE]
VD9mc  LTST-S220GKT  [0805 DIODE]
VD10mc  LTST-S220GKT  [0805 DIODE]
VD11mc  LTST-S220GKT  [0805 DIODE]
VD12mc  LTST-S220GKT  [0805 DIODE]
VD13mc  LTST-S220GKT  [0805 DIODE]
VD14mc  ESDLC3V3D3B-TP  [SOD-323 (UNMARKED)]
VD15mc  ESDLC3V3D3B-TP  [SOD-323 (UNMARKED)]
VD16mc  PUSB3AB6Z  [DFN2111-7 (SOT1358-1)]
VD17mc  ESDLC3V3D3B-TP  [SOD-323 (UNMARKED)]
VD18mc  ESDLC3V3D3B-TP  [SOD-323 (UNMARKED)]
VD19mc  PUSB3AB6Z  [DFN2111-7 (SOT1358-1)]
X1mc  TSW-104-07-F-D  [HEADER 2.54mm 2ROW 8PIN]  (value not drawn)
X2mc  KF141V-2.54-6P  [KF141V-2.54-6P]
X3mc  KF141V-2.54-5P  [KF141V-2.54-5P]
X4mc  114-00841-68  [114-00841-68]
X5mc  KF141V-2.54-5P  [KF141V-2.54-5P]
ZQ1mc  ABM3-8.000MHZ-D2Y-T  [ABM3-8.000MHZ-D2Y-T]  (value not drawn)

### Nets
+3.3V: C1mc.1 C3mc.1 C4mc.1 C5mc.1 C10mc.1 C11mc.1 C12mc.1 C13mc.1 C14mc.1 C15mc.1 C16mc.1 C17mc.1 C18mc.1 C19mc.1 C20mc.1 C21mc.1 C22mc.1 C23mc.2 C24mc.1 DD1mc.6(VBAT) DD1mc.11(Vdd) DD1mc.19(Vdd) DD1mc.21(Vref+) DD1mc.22(Vdda) DD1mc.28(Vdd) DD1mc.50(Vdd) DD1mc.75(Vdd) DD1mc.100(Vdd) DD2mc.5(V+) DD3mc.1(EN) DD3mc.4(VCC) DD4mc.1(VCC) R1mc.2 R2mc.2 R3mc.2 R19mc.2 R20mc.1 R21mc.1 R22mc.1 R23mc.1 R24mc.1 R25mc.1 VD18mc.2 X1mc.4 X1mc.5 X4mc.4(Vss) X5mc.4
+12V: X3mc.3
BOOT0_LoRa_MK: DD1mc.85(PD4)
DI0_LED: DD1mc.42(PE11) R11mc.2
DI0_MK: DD1mc.39(PE8)
DI1_LED: DD1mc.43(PE12) R12mc.2
DI1_MK: DD1mc.40(PE9)
DI2_LED: DD1mc.44(PE13) R13mc.2
DI2_MK: DD1mc.41(PE10)
DO0_MK: DD1mc.97(PE0) R10mc.2
DO1_MK: DD1mc.98(PE1) R9mc.2
DO2_MK: DD1mc.1(PE2) R8mc.2
DO3_MK: DD1mc.2(PE3) R7mc.2
DO4_MK: DD1mc.3(PE4) R6mc.2
DO5_MK: DD1mc.4(PE5) R5mc.2
ESP_EN: DD1mc.25(PA2)
ESP_MK_RX: DD1mc.23(PA0)
ESP_MK_TX: DD1mc.24(PA1)
GND: C1mc.2 C2mc.2 C3mc.2 C4mc.2 C5mc.2 C6mc.1 C7mc.2 C8mc.2 C9mc.1 C10mc.2 C11mc.2 C12mc.2 C13mc.2 C14mc.2 C15mc.2 C16mc.2 C17mc.2 C18mc.2 C19mc.2 C20mc.2 C21mc.2 C22mc.2 C23mc.1 C24mc.2 DD1mc.10(Vss) DD1mc.20(Vssa) DD1mc.27(Vss) DD1mc.74(Vss) DD1mc.99(Vss) DD2mc.2(GND) DD2mc.4(AVDD0) DD3mc.5(GND) DD3mc.8(EN*) DD4mc.2(GND) R4mc.1 VD1mc.2 VD2mc.2 VD3mc.2 VD4mc.2 VD5mc.2 VD6mc.2 VD7mc.2 VD8mc.2 VD9mc.2 VD10mc.2 VD11mc.2 VD12mc.2 VD13mc.2 VD14mc.1 VD15mc.1 VD16mc.2 VD17mc.1 VD18mc.1 VD19mc.2 X1mc.2 X1mc.7 X3mc.4 X4mc.6(Vcc) X4mc.11(GND) X4mc.12(GND) X4mc.13(GND) X4mc.14(GND) X5mc.5
GSM_EN: DD1mc.57(PD10)
GSM_STATUS: DD1mc.56(PD9)
LORA_LINK: DD1mc.45(PE14) R15mc.2
LoRa_UART2_RX: DD1mc.68(PA9)
LoRa_UART2_TX: DD1mc.69(PA10)
LVDS_ADC_CS+: DD3mc.15(DOUT1+) VD16mc.7 X2mc.1
LVDS_ADC_CS-: DD3mc.16(DOUT1-) VD16mc.6 X2mc.2
LVDS_ADC_MISO+: DD4mc.3(RIN+) R18mc.1 VD14mc.2
LVDS_ADC_MISO-: DD4mc.4(RIN-) R18mc.2 VD15mc.2 X3mc.1
LVDS_ADC_MOSI+: DD3mc.11(DOUT3+) VD16mc.3 X2mc.5
LVDS_ADC_MOSI-: DD3mc.12(DOUT3-) VD16mc.1 X2mc.6 X3mc.2
LVDS_ADC_SCK+: DD3mc.14(DOUT2+) VD16mc.5 X2mc.3
LVDS_ADC_SCK-: DD3mc.13(DOUT2-) VD16mc.4 X2mc.4
MK_GSM_RX: DD1mc.48(PB11)
MK_GSM_TX: DD1mc.47(PB10)
MK_LVDS_CS: DD1mc.29(PA4) DD3mc.2(DIN1)
MK_LVDS_MISO: DD1mc.31(PA6) DD4mc.5(ROUT)
MK_LVDS_MOSI: DD1mc.32(PA7) DD3mc.6(DIN3)
MK_LVDS_SCK: DD1mc.30(PA5) DD3mc.3(DIN2)
MK_To_RFID_EN: DD1mc.67(PA8)
MK_To_RFID_GPI: DD1mc.61(PD14)
MK_To_RFID_GPO: DD1mc.62(PD15)
MK_to_RFID_RX: DD1mc.64(PC7)
MK_to_RFID_TX: DD1mc.63(PC6)
NRST: C2mc.1 DD1mc.14(NRST) X1mc.1
NRST_LoRa: DD1mc.84(PD3)
PE: X3mc.5
RFID_HEAT: DD1mc.60(PD13)
RFID_LINK: DD1mc.46(PE15) R14mc.2
SDIO_CLK: DD1mc.80(PC12) R22mc.2 VD19mc.5 X4mc.5(CLK)
SDIO_CMD: DD1mc.83(PD2) R21mc.2 VD19mc.4 X4mc.3(C/R)
SDIO_D0: DD1mc.65(PC8) R23mc.2 VD19mc.6 X4mc.7(DAT0)
SDIO_D1: DD1mc.66(PC9) R24mc.2 VD19mc.7 X4mc.8(DAT1)
SDIO_D2: DD1mc.78(PC10) R19mc.1 VD19mc.1 X4mc.1(DAT2)
SDIO_D3: DD1mc.79(PC11) R20mc.2 VD19mc.3 X4mc.2(DAT3)
SDIO_DET: R25mc.2 VD17mc.2 X4mc.9(CD_SW1)
SWCLK: DD1mc.76(SWCLK) X1mc.6
SWDIO: DD1mc.72(SWDIO) X1mc.8
SWO: DD1mc.89(SWO) X1mc.3
TS1_ALERT: DD1mc.91(PB5)
TS2_ALERT: DD1mc.92(PB6) DD2mc.3(ALERT) R1mc.1 X5mc.3
TS_SCL: DD1mc.95(PB8) DD2mc.1(SCL) R2mc.1 X5mc.2
TS_SDA: DD1mc.93(PB7) DD2mc.6(SDA) R3mc.1 X5mc.1
ADC_LINK: DD1mc.58(PD11) R17mc.2
NetC6mc_2: C6mc.2 DD1mc.12(OSC_IN) ZQ1mc.2
NetC7mc_1: C7mc.1 DD1mc.49(VCAP_1)
NetC8mc_1: C8mc.1 DD1mc.73(VCAP_2)
NetC9mc_2: C9mc.2 DD1mc.13(OSC_OUT) ZQ1mc.1
NetDD1mc_59: DD1mc.59(PD12) R16mc.2
NetDD1mc_94: DD1mc.94(BOOT0) R4mc.2
NetR5mc_1: R5mc.1 VD1mc.1
NetR6mc_1: R6mc.1 VD2mc.1
NetR7mc_1: R7mc.1 VD3mc.1
NetR8mc_1: R8mc.1 VD4mc.1
NetR9mc_1: R9mc.1 VD5mc.1
NetR10mc_1: R10mc.1 VD6mc.1
NetR11mc_1: R11mc.1 VD7mc.1
NetR12mc_1: R12mc.1 VD8mc.1
NetR13mc_1: R13mc.1 VD9mc.1
NetR14mc_1: R14mc.1 VD10mc.1
NetR15mc_1: R15mc.1 VD11mc.1
NetR16mc_1: R16mc.1 VD12mc.1
NetR17mc_1: R17mc.1 VD13mc.1

Not connected (* = marked no-connect by the designer): DD1mc 5(PE6) 7(PC13) 8(OSC32_IN)* 9(OSC32_OUT)* 15(PC0) 16(PC1) 17(PC2) 18(PC3) 26(PA3) 33(PC4) 34(PC5) 35(PB0) 36(PB1) 37(BOOT1)* 38(PE7) 51(PB12) 52(PB13) 53(PB14) 54(PB15) 55(PD8) 70(PA11) 71(PA12) 77(JTDI) 81(PD0) 82(PD1) 86(PD5) 87(PD6) 88(PD7) 90(NJTRST)* 96(PB9); DD3mc 7(DIN4)* 9(DOUT4-)* 10(DOUT4+)*; X4mc 10(CD_SW2)*

### Notes on the sheet
- NRST
- SWO
- GND
- +3.3V
- (near DD1mc) Out
- (near DD1mc) UART4_RX
- (near DD1mc) SPI1_CS
- (near DD1mc) SPI1_SCK
- SWCLK
- (near DD1mc) USART1_TX
- (near DD1mc) USART1_RX
- (near DD1mc) SPI1_MOSI
- (near DD1mc) SPI1_MISO
- (near DD1mc) UART4_TX
- SWDIO
- (near DD1mc) In
- (near DD1mc) USART3_TX
- (near DD1mc) USART3_RX
- (near DD1mc) I2C1_SDA
- (near DD1mc) I2C1_SCL
- (near DD1mc) SDIO
- (near DD1mc) USART6_TX
- (near DD1mc) USART6_RX
- (near X2mc) LVDS_ADC_CS+
- (near X2mc) LVDS_ADC_CS-
- (near X2mc) LVDS_ADC_SCK+
- (near X2mc) LVDS_ADC_SCK-
- (near X2mc) LVDS_ADC_MOSI+
- (near X2mc) LVDS_ADC_MOSI-
- (near X3mc) LVDS_ADC_MISO-
- (near X3mc) LVDS_ADC_MISO+
- +12V
- PE
- TS_SCL
- TS_SDA
- (near X5mc) TS2_ALERT
- (in symbol 114-00841-68) uSD
- (in symbol DSLVDS1047PWR) LVDS; 4xTX
- (in symbol FIN1002M5X) LVDS; 1xRX
- (in symbol KF141V-2.54-5P) Цепь
- (in symbol KF141V-2.54-6P) Цепь
- (in symbol STM32F407VGT6, part A) MCU; PB2/; PB4/; PA15/; JTCK/; /JTMS/PA13; /JTDO/ PB3/; / WKUP/
- (in symbol STM32F407VGT6, part B) MCU; /PC14; /PC15; /PH0; /PH1
- (in symbol TMP112AIDRLR) t°C / #
- (in symbol TSW-104-07-F-D) Цепь

### Library data of the parts
C1mc C2mc C4mc C15mc C16mc C17mc C18mc C19mc C20mc C21mc C24mc = GCM188R71H104KA57D: as C9p on sheet Схема питания Velvet Controller; Manufacturer Part Number 1: GCM188R71H104KA57D; Min Operating Temperature: -55°C; Max Operating Temperature: 125°C; Mounting: SM; Package: 0603; Supplier 1: Digi-Key; Supplier Part Number 1: 490-4779-1-ND
C3mc = GCM188R71H102KA37D: CAP SMD CER 1000PF 50V X7R 0603; Manufacturer 1: Murata Electronics; Tolerance: 10%; Type: Multilayer Ceramic; Manufacturer Part Number 1: GCM188R71H102KA37D; Min Operating Temperature: -55°C; Max Operating Temperature: 125°C; Mounting: SM; Package: 0603; Supplier 1: Digi-Key; Supplier Part Number 1: 490-4777-1-ND
C5mc C13mc C14mc = CL10B103KB8NNNC: CAP SMD CER 10000PF 50V X7R 0603; Manufacturer 1: Samsung Electro-Mechanics; Tolerance: 10%; Type: Multilayer Ceramic; Manufacturer Part Number 1: CL10B103KB8NNNC; Min Operating Temperature: -55°C; Max Operating Temperature: 125°C; Mounting: SM; Package: 0603; Supplier 1: Digi-Key; Supplier Part Number 1: 1276-1009-1-ND
C6mc C9mc = CC0603JRNPO9BN220: CAP SMD CER 22PF 50V NP0  0603; Manufacturer 1: YAGEO; Tolerance: 5%; Type: Multilayer Ceramic; Manufacturer Part Number 1: CC0603JRNPO9BN220; Min Operating Temperature: -55°C; Max Operating Temperature: 125°C; Mounting: SM; Package: 0603; Supplier 1: Digi-Key; Supplier Part Number 1: 311-1062-1-ND
C7mc C8mc C12mc = GRM188R61E225KA12D: CAP SMD CER 2.2UF 25V X5R 0603; Manufacturer 1: Murata Electronics; Tolerance: 10%; Type: Multilayer Ceramic; Manufacturer Part Number 1: GRM188R61E225KA12D; Min Operating Temperature: -55°C; Max Operating Temperature: 85°C; Mounting: SM; Package: 0603; Supplier 1: Digi-Key; Supplier Part Number 1: 490-10731-1-ND
C10mc C11mc C23mc = TMK107BJ105KA-T: as C12p on sheet Схема питания Velvet Controller; Manufacturer Part Number 1: TMK107BJ105KA-T; Min Operating Temperature: -55°C; Max Operating Temperature: 85°C; Mounting: SM; Package: 0603; Supplier 1: Digi-Key; Supplier Part Number 1: 587-1248-1-ND
C22mc = CL21A475KBQNNNE: as C6p on sheet Схема питания Velvet Controller; Manufacturer Part Number 1: CL21A475KBQNNNE; Min Operating Temperature: -55°C; Max Operating Temperature: 85°C; Mounting: SM; Package: 0805; Supplier 1: Digi-Key; Supplier Part Number 1: 1276-1248-1-ND
DD1mc = STM32F407VGT6: IC MCU 32BIT 1MB FLASH 100LQFP; Manufacturer 1: STMicroelectronics; Core Size: 32-Bit Single-Core; Speed: 168MHz; Number of I/O: 82; Program Memory Size: 1MB (1M x 8); RAM Size: 192K x 8; Voltage - Supply (Vcc/Vdd): 1.8V ~ 3.6V; Number Of DAC: 2x12b; Number Of ADC: 16x12b; Core Processor: ARM® Cortex®-M4; Manufacturer Part Number 1: STM32F407VGT6; Program Memory Type: FLASH; Mounting Type: SM; Min Operating Temperature: -40°C; Max Operating Temperature: 85°C; Package / Case: 100-LQFP (14x14)
DD2mc = TMP112AIDRLR: SOT-563 TEMPERATURE SENSORS ROHS; Manufacturer 1: UMW; Max Accuracy: ±0.1°C; Min Accuracy: ±1°C; Resolution: 12b; Interface: I²C/SMBus; Manufacturer Part Number 1: TMP112AIDRLR; Max Operating Temperature: 150°C; Min Operating Temperature: -55°C; Mounting Type: SM; Package: SOT-563; Supplier 1: Digi-Key; Supplier Part Number 1: 296-38578-1-ND
DD3mc = DSLVDS1047PWR: IC DRIVER LVDS FULL 4/0 16TSSOP; Manufacturer 1: Texas Instruments; Number Of Receivers: 0; Number Of Drivers: 4; Data Rate: 400Mbps; Voltage Supply Range: 3...3.6V; Manufacturer Part Number 1: DSLVDS1047PWR; Min Operating Temperature: -40°C; Max Operating Temperature: 85°C; Package: 16-TSSOP; Mounting: SM; Supplier 1: Digi-Key; Supplier Part Number 1: 296-50740-1-ND
DD4mc = FIN1002M5X: IC RECEIVER LVDS 0/1 SOT23-5; Manufacturer 1: onsemi; Number Of Receivers: 1; Number Of Drivers: 0; Data Rate: 400Mbps; Voltage Supply Range: 3...3.6V; Manufacturer Part Number 1: FIN1002M5X; Min Operating Temperature: -40°C; Max Operating Temperature: 125°C; Package: SOT-23-5; Mounting: SM; Supplier 1: Digi-Key; Supplier Part Number 1: FIN1002M5XCT-ND
R1mc R2mc R3mc = RC0603FR-074K99L: RES SMD 4.99K OHM 1% 1/10W 0603; Manufacturer 1: YAGEO; Rated Voltage: 75V; Manufacturer Part Number 1: RC0603FR-074K99L; Tolerance: 1%; Package: 0603; Min Operating Temperature: -55°C; Max Operating Temperature: 155°C; Qualification: -
R4mc = RMCF0603JT10K0: RES SMD 10K OHM 5% 1/10W 0603; Manufacturer 1: Stackpole Electronics Inc; Voltage Rated: 75V; Manufacturer Part Number 1: RMCF0603JT10K0; Min Operating Temperature: -55°C; Max Operating Temperature: 155°C; Tolerance: 5%; Package: 0603; Ratings: AEC-Q200; Supplier 1: Digi-Key; Supplier Part Number 1: RMCF0603JT10K0CT-ND
R5mc R6mc R7mc R8mc R9mc R10mc R11mc R12mc R13mc R14mc R15mc R16mc R17mc = RMCF0603JT510R: RES SMD 510 OHM 5% 1/10W 0603; Manufacturer 1: Stackpole Electronics Inc; Voltage Rated: 75V; Manufacturer Part Number 1: RMCF0603JT510R; Min Operating Temperature: -55°C; Max Operating Temperature: 155°C; Tolerance: 5%; Package: 0603; Ratings: AEC-Q200; Supplier 1: Digi-Key; Supplier Part Number 1: RMCF0603JT510RCT-ND
R18mc = RMCF0603FT100R: RES SMD 100 OHM 1% 1/10W 0603; Manufacturer 1: Stackpole Electronics Inc; Rated Voltage: 75V; Qualification: AEC-Q200; Manufacturer Part Number 1: RMCF0603FT100R; Tolerance: 1%; Package: 0603; Min Operating Temperature: -55°C; Max Operating Temperature: 155°C; Supplier 1: Digi-Key; Supplier Part Number 1: RMCF0603FT100RCT-ND
R19mc R20mc R21mc R22mc R23mc R24mc R25mc = RMCF0603FT33K0: as R14p on sheet Схема питания Velvet Controller; Manufacturer Part Number 1: RMCF0603FT33K0; Min Operating Temperature: -55°C; Max Operating Temperature: 155°C; Tolerance: 1%; Package: 0603; Ratings: AEC-Q200; Supplier 1: Digi-Key
VD1mc VD2mc VD3mc VD4mc VD5mc VD6mc VD7mc VD8mc VD9mc VD10mc VD11mc VD12mc VD13mc = LTST-S220GKT: as VD2p on sheet Схема питания Velvet Controller; Manufacturer Part Number 1: LTST-S220GKT; Max Operating Temperature: +85°C; Package: 0805
VD14mc VD15mc VD17mc VD18mc = ESDLC3V3D3B-TP: TVS DIODE 3.3VWM 36VC SOD323; Manufacturer 1: Micro Commercial Co; Voltage - Reverse Standoff (Typ): 3.3V; Voltage - Breakdown (Min): 4V; Voltage - Clamping (Max) @ Ipp: 36V; Current - Peak Pulse (10/1000µs): 28A (8/20µs); Type: Biderectional; Number Of Chanels: 6; Max Pulse Power: 350W; Manufacturer Part Number 1: ESDLC3V3D3B-TP; Mounting: SM; Max Operating Temperature: 150°C; Min Operating Temperature: -55°C; Package: SOD-323
VD16mc VD19mc = PUSB3AB6Z: TVS DIODE 3.3VWM 6VC 7XSON; Manufacturer 1: Nexperia USA Inc.; Voltage - Reverse Standoff (Typ): 3.3V (Max); Voltage - Breakdown (Min): 6V; Voltage - Clamping (Max) @ Ipp: 6V (Typ); Current - Peak Pulse (10/1000µs): 5A (8/20µs); Type: Biderectional; Number Of Chanels: 6; Manufacturer Part Number 1: PUSB3AB6Z; Mounting: SM; Max Operating Temperature: 85°C; Min Operating Temperature: -40°C; Package: 7-XFDFN
X1mc = TSW-104-07-F-D: CONN HEADER VERT 8POS 2.54MM 2ROWx4; Manufacturer 1: Samtec Inc.; Rated Voltage: 400V; Rated Current: 2A; Contact Length - Mating: 5.84mm; Overall Contact Length: 10.92mm; Min Operating Temperatire: -55℃; Max Operating Temperature: 125℃; Contact Length - Post: 2.54mm; Insulation Height: 2.54mm; Manufacturer Part Number 1: TSW-104-07-F-D; Pitch: 2.54mm; Supplier 1: Digi-Key; Supplier Part Number 1: SAM8996-ND
X2mc = KF141V-2.54-6P: TERMINAL BLOCK 6 PIN 2.54mm 2A 150V T/H; pin to pad: 1>1+7 2>2+8 3>3+9 4>4+10 5>5+11 6>6+12; Manufacturer 1: CIXI KEFA ELECTRONICS CO.,LTD.; Rated Current: 10A; Suitable Wire: 20...26AWG; Pitch: 2.54mm x 5.08mm; Rated Voltage: 150V; Min Operating Temperatire: -40℃; Max Operating Temperature: 105℃; Pins: 6+6; Manufacturer Part Number 1: KF141V-2.54-6P; Max Length: 17.78mm; Max Width: 12.7mm; Max Height: 13.8mm
X3mc X5mc = KF141V-2.54-5P: TERMINAL BLOCK 5 PIN 2.54mm 2A 150V T/H; pin to pad: 1>1+6 2>2+7 3>3+8 4>4+9 5>5+10; Manufacturer 1: CIXI KEFA ELECTRONICS CO.,LTD.; Rated Current: 10A; Suitable Wire: 20...26AWG; Pitch: 2.54mm x 5.08mm; Rated Voltage: 150V; Min Operating Temperatire: -40℃; Max Operating Temperature: 105℃; Pins: 5+5; Manufacturer Part Number 1: KF141V-2.54-5P; Max Length: 15.24mm; Max Width: 12.7mm; Max Height: 13.8mm
X4mc = 114-00841-68: CONN MICRO SD CARD PUSH-PULL R/A; Manufacturer 1: Amphenol ICC (Commercial Products); Card Type: Secure Digital - microSD™; Number of Positions: 10 (8 + 2); Connector Type: Connector; Insertion, Removal Method: Push In, Pull Out; Manufacturer Part Number 1: 114-00841-68; Features: Switch; Mounting: SM; Contact Finish: Gold; Contact Finish Thickness: 0.38µm; Supplier 1: Digi-Key; Supplier Part Number 1: 114-00841-68-1-ND
ZQ1mc = ABM3-8.000MHZ-D2Y-T: CRYSTAL 8.0000MHZ 18PF SMD; Manufacturer 1: Abracon LLC; Frequency: 8MHz; Frequency Stability: ±30ppm; ESR (Equivalent Series Resistance): 140 Ohms; Manufacturer Part Number 1: ABM3-8.000MHZ-D2Y-T; Mounting Type: SM; Package: 2-SMD, No Lead; Load Capacitance: 18pF; Max Operating Temperature: 85°C; Min Operating Temperature: -40°C